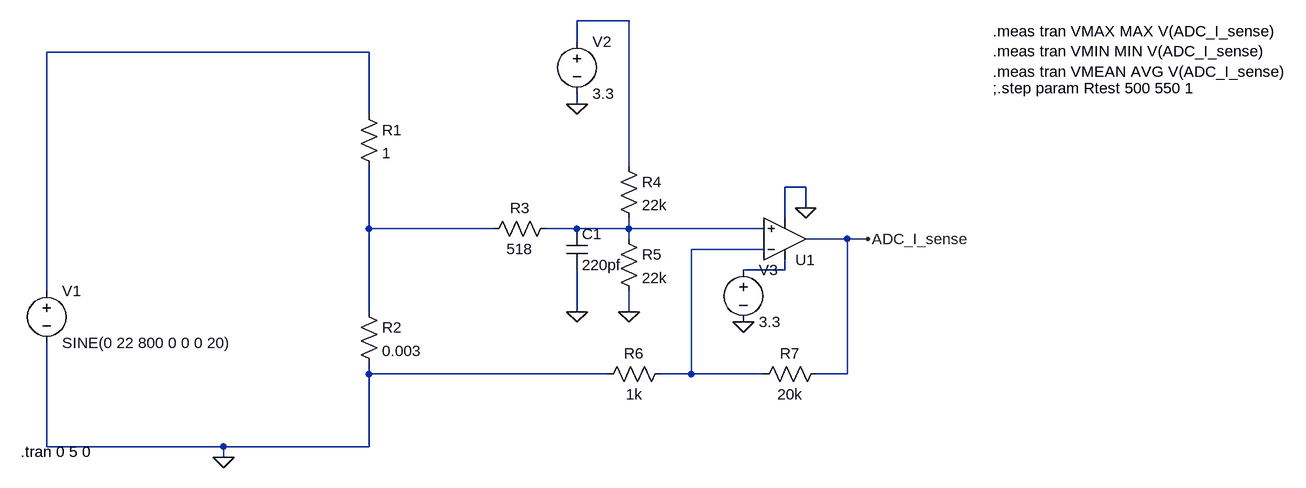
[diagram p0: schematic current-sense.asc]
current-sense.asc, the LTspice schematic file:
Version 4.1
SHEET 1 1988 680
WIRE 960 -288 880 -288
WIRE 880 -256 880 -288
WIRE 560 -240 64 -240
WIRE 880 -160 880 -176
WIRE 560 -144 560 -240
WIRE 960 -64 960 -288
WIRE 1232 -32 1200 -32
WIRE 1232 0 1232 -32
WIRE 1200 16 1200 -32
WIRE 560 32 560 -64
WIRE 752 32 560 32
WIRE 880 32 832 32
WIRE 960 32 960 16
WIRE 960 32 880 32
WIRE 1168 32 960 32
WIRE 960 48 960 32
WIRE 1296 48 1232 48
WIRE 1328 48 1296 48
WIRE 1168 64 1056 64
WIRE 1200 96 1200 80
WIRE 1200 96 1136 96
WIRE 64 128 64 -240
WIRE 560 160 560 32
WIRE 880 160 880 96
WIRE 960 160 960 128
WIRE 560 256 560 240
WIRE 928 256 560 256
WIRE 1056 256 1056 64
WIRE 1056 256 1008 256
WIRE 1168 256 1056 256
WIRE 1296 256 1296 48
WIRE 1296 256 1248 256
WIRE 64 368 64 208
WIRE 336 368 64 368
WIRE 560 368 560 256
WIRE 560 368 336 368
WIRE 336 384 336 368
FLAG 880 -160 0
FLAG 960 160 0
FLAG 1232 0 0
FLAG 1136 176 0
FLAG 1328 48 ADC_I_sense
FLAG 336 384 0
FLAG 880 160 0
SYMBOL voltage 64 112 R0
WINDOW 123 0 0 Left 0
WINDOW 39 0 0 Left 0
SYMATTR InstName V1
SYMATTR Value SINE(0 22 800 0 0 0 20)
SYMBOL res 544 -160 R0
SYMATTR InstName R1
SYMATTR Value 1
SYMBOL res 544 144 R0
SYMATTR InstName R2
SYMATTR Value 0.003
SYMBOL res 848 16 R90
WINDOW 0 0 56 VBottom 2
WINDOW 3 32 56 VTop 2
SYMATTR InstName R3
SYMATTR Value 518
SYMBOL OpAmps\\UniversalOpAmp2 1200 48 M180
SYMATTR InstName U1
SYMATTR Value2 Avol=1Meg GBW=20Meg Slew=10Meg
SYMATTR SpiceLine Ilimit=35m Rail=50m Vos=4.5m
SYMATTR SpiceLine2 En=21n Enk=10 In=1p Ink=10 Rin=500Meg
SYMBOL res 944 -80 R0
SYMATTR InstName R4
SYMATTR Value 22k
SYMBOL res 944 32 R0
SYMATTR InstName R5
SYMATTR Value 22k
SYMBOL res 1024 240 R90
WINDOW 0 0 56 VBottom 2
WINDOW 3 32 56 VTop 2
SYMATTR InstName R6
SYMATTR Value 1k
SYMBOL res 1264 240 R90
WINDOW 0 0 56 VBottom 2
WINDOW 3 32 56 VTop 2
SYMATTR InstName R7
SYMATTR Value 20k
SYMBOL voltage 880 -272 R0
WINDOW 123 0 0 Left 0
WINDOW 39 0 0 Left 0
SYMATTR InstName V2
SYMATTR Value 3.3
SYMBOL voltage 1136 80 R0
WINDOW 123 0 0 Left 0
WINDOW 39 0 0 Left 0
SYMATTR InstName V3
SYMATTR Value 3.3
SYMBOL cap 864 32 R0
SYMATTR InstName C1
SYMATTR Value 220pf
TEXT 24 376 Left 2 !.tran 0 5 0
TEXT 1520 -184 Left 2 !;.step param Rtest 500 550 1
TEXT 1520 -272 Left 2 !.meas tran VMAX MAX V(ADC_I_sense)\n.meas tran VMIN MIN V(ADC_I_sense)\n.meas tran VMEAN AVG V(ADC_I_sense)

The netlist it stands for:
* current-sense.asc
V1 N002 0 SINE(0 22 800 0 0 0 20)
R1 N002 N003 1
R2 N003 0 0.003
R3 N004 N003 518
X§U1 N004 N005 N006 0 ADC_I_sense level2 Avol=1Meg GBW=20Meg Slew=10Meg Ilimit=35m Rail=50m Vos=4.5m En=21n Enk=10 In=1p Ink=10 Rin=500Meg  ; pins In+ In- V+ V- OUT
R4 N001 N004 22k
R5 N004 0 22k
R6 N005 0 1k
R7 ADC_I_sense N005 20k
V2 N001 0 3.3
V3 N006 0 3.3
C1 N004 0 220pf
.tran 0 5 0
;.step param Rtest 500 550 1
.meas tran VMAX MAX V(ADC_I_sense)
.meas tran VMIN MIN V(ADC_I_sense)
.meas tran VMEAN AVG V(ADC_I_sense)
.lib UniversalOpAmp2.lib
.backanno
.end